# EAGLE design mod.B (EAGLE 7.5.0)
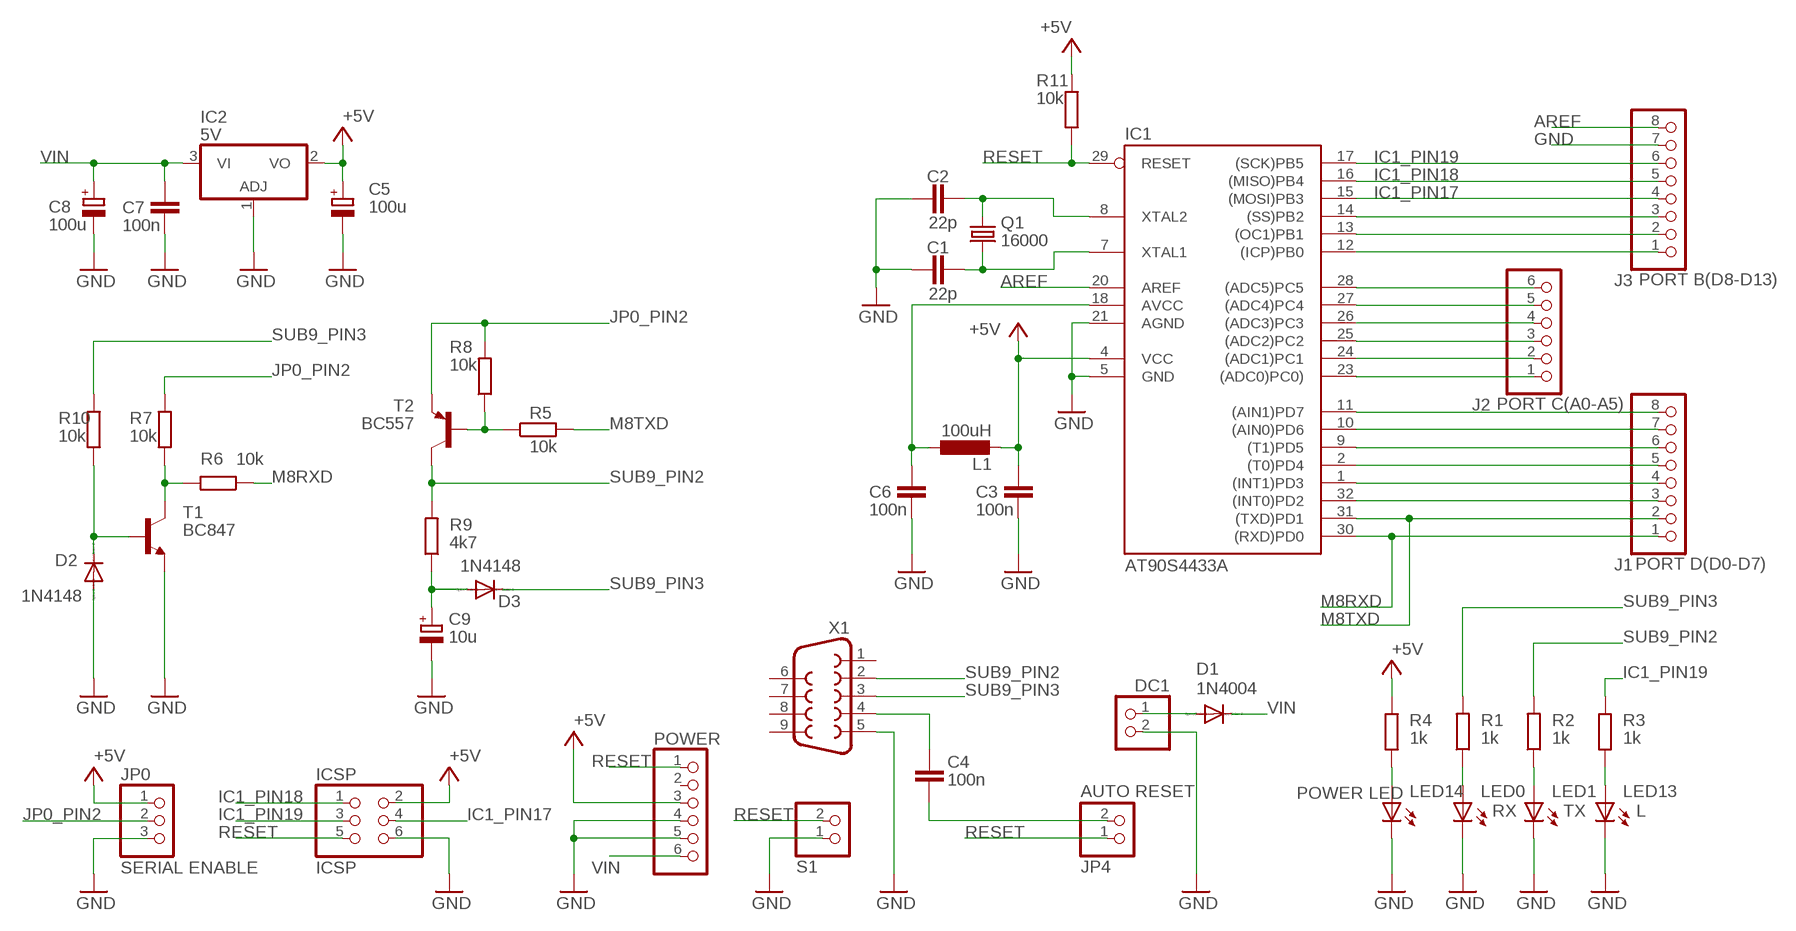
[diagram p0: schematic, sheet 1]

## Parts
C1  22p  C-EUC0805  [C0805]
C2  22p  C-EUC0805  [C0805]
C3  100n  C-EUC0805  [C0805]
C4  100n  C-EUC0805  [C0805]
C5  100u  CPOL-EUD  [PANASONIC_D]
C6  100n  C-EUC0805  [C0805]
C7  100n  C-EUC0805  [C0805]
C8  100u  CPOL-EUD  [PANASONIC_D]
C9  10u  CPOL-EUB  [PANASONIC_B]
D1  1N4004  DIODE-SOD80C  [SOD80C]
D2  1N4148  DIODE-SOD80C  [SOD80C]
D3  1N4148  DIODE-SOD80C  [SOD80C]
DC1  PINHD-1X2  [1X02]
IC1  AT90S4433A  [TQFP32-08]
IC2  5V  AMS1117  [SOT223]
ICSP  ICSP  PINHD-2X3  [2X03]
J1  PORT D(D0-D7)  PINHD-1X8  [1X08]
J2  PORT C(A0-A5)  PINHD-1X6  [1X06]
J3  PORT B(D8-D13)  PINHD-1X8  [1X08]
JP0  SERIAL ENABLE  PINHD-1X3  [1X03]
JP4  AUTO RESET  PINHD-1X2  [1X02]
L1  100uH  L-EUL1812  [L1812]
LED0  RX  LEDCHIP-LED0603  [CHIP-LED0603]
LED1  TX  LEDCHIP-LED0603  [CHIP-LED0603]
LED13  L  LEDCHIP-LED0603  [CHIP-LED0603]
LED14  POWER LED  LEDCHIP-LED0603  [CHIP-LED0603]
POWER  PINHD-1X6  [1X06]
Q1  16000  CRYSTALSM49  [SM49]
R1  1k  R-EU_M0805  [M0805]
R2  1k  R-EU_M0805  [M0805]
R3  1k  R-EU_M0805  [M0805]
R4  1k  R-EU_M0805  [M0805]
R5  10k  R-EU_M0805  [M0805]
R6  10k  R-EU_M0805  [M0805]
R7  10k  R-EU_M0805  [M0805]
R8  10k  R-EU_M0805  [M0805]
R9  4k7  R-EU_R1206  [R1206]
R10  10k  R-EU_M0805  [M0805]
R11  10k  R-EU_M0805  [M0805]
S1  PINHD-1X2  [1X02]
T1  BC847  [SOT23]
T2  BC557  BC857A-PNP-SOT23-BEC  [SOT23-BEC]
X1  F09H  [F09H]

## Nets
+5V [POWER]: C3.1 C5.+ IC1.4(VCC) IC2.2(VO) ICSP.2 JP0.1 L1.2 POWER.3 R4.1 R11.2
AREF [GND]: IC1.20(AREF) J3.8
GND [GND]: C1.1 C2.1 C3.2 C5.- C6.2 C7.2 C8.- C9.- D2.A DC1.2 IC1.5(GND) IC1.21(AGND) IC2.1(ADJ) ICSP.6 J3.7 JP0.3 LED0.C LED1.C LED13.C LED14.C POWER.4 POWER.5 S1.1 T1.2(E) X1.5
IC1_PIN17: IC1.15((MOSI)PB3) ICSP.4 J3.4
IC1_PIN18: IC1.16((MISO)PB4) ICSP.1 J3.5
IC1_PIN19: IC1.17((SCK)PB5) ICSP.3 J3.6 R3.1
JP0_PIN2: JP0.2 R7.2 R8.2 T2.E
M8RXD: IC1.30((RXD)PD0) J1.1 R6.1
M8TXD: IC1.31((TXD)PD1) J1.2 R5.2
N$1: IC1.28((ADC5)PC5) J2.6
N$2: IC1.27((ADC4)PC4) J2.5
N$3: IC1.26((ADC3)PC3) J2.4
N$4: IC1.25((ADC2)PC2) J2.3
N$5: IC1.24((ADC1)PC1) J2.2
N$6: IC1.23((ADC0)PC0)) J2.1
N$7: IC1.11((AIN1)PD7) J1.8
N$8: IC1.10((AIN0)PD6) J1.7
N$9: IC1.9((T1)PD5) J1.6
N$10: IC1.2((T0)PD4) J1.5
N$11: IC1.1((INT1)PD3) J1.4
N$12: IC1.32((INT0)PD2) J1.3
N$13: LED14.A R4.2
N$14: R5.1 R8.1 T2.B
N$15: IC1.12((ICP)PB0) J3.1
N$16: IC1.13((OC1)PB1) J3.2
N$17: IC1.14((SS)PB2) J3.3
N$20: LED13.A R3.2
N$22: C4.1 X1.4
N$23: LED1.A R2.1
N$25: C9.+ D3.A R9.1
N$26: D1.A DC1.1
N$27: C4.2 JP4.2
N$28: D2.C R10.1 T1.1(B)
N$29: R6.2 R7.1 T1.3(C)
N$30: LED0.A R1.1
N$31: C1.2 IC1.7(XTAL1) Q1.1
N$32: C2.2 IC1.8(XTAL2) Q1.2
N$33: C6.1 IC1.18(AVCC) L1.1
RESET: IC1.29(RESET) ICSP.5 JP4.1 POWER.1 R11.1 S1.2
SUB9_PIN2: R2.2 R9.2 T2.C X1.2
SUB9_PIN3: D3.C R1.2 R10.2 X1.3
VIN [POWER]: C7.1 C8.+ D1.C IC2.3(VI) POWER.6
Unconnected: POWER.2 X1.1 X1.6 X1.7 X1.8 X1.9

## Library data of the parts
C1-C4 C6 C7 = resistor:C-EU: CAPACITOR, European symbol
C5 C8 C9 = resistor:CPOL-EU: POLARIZED CAPACITOR, European symbol
D1-D3 = diode:DIODE-: DIODE
DC1 JP4 S1 = pinhead:PINHD-1X2: PIN HEADER
IC1 = atmel:AT90S4433: MICROCONTROLLER 4 Kbytes FLASH 128 bytes SRAM 256 bytes EEPROM UART 6-channel 10 bit ADC; OC_FARNELL: unknown; OC_NEWARK: unknown
IC2 = linear_extended:AMS1117
ICSP = pinhead:PINHD-2X3: PIN HEADER
J1 J3 = pinhead:PINHD-1X8: PIN HEADER
J2 POWER = pinhead:PINHD-1X6: PIN HEADER
JP0 = pinhead:PINHD-1X3: PIN HEADER
L1 = resistor:L-EU: INDUCTOR, European symbol
LED0 LED1 LED13 LED14 = led:LED: LED OSRAM: - CHIPLED LG R971, LG N971, LY N971, LG Q971, LY Q971, LO R971, LY R971 LH N974, LH R974 LS Q976, LO Q976, LY Q976 LO Q996 - Hyper CHIPLED LW Q18S LB Q993, LB Q99A, LB R99A - SideLED LS A670, LO A670, LY A670, LG A670, LP A670 LB A673, LV A673, LT A673, LW A673 LH A674 LY A675 LS A676, LA A676, LO A676, LY A676, LW A676 LS A679, LY A679, LG A679 - Hyper Micro SIDELED® LS Y876, LA Y876, LO Y876, LY Y876 LT Y87S - SmartLED LW L88C, LW L88S LB L89C, LB L89S, LG L890 LS L89K, LO L89K, LY L89K LS L896, LA L896, LO L896, LY L896 - TOPLED LS T670, LO T670, LY T670, LG T670, LP T670 LSG T670, LSP T670, LSY T670, LOP T670, LYG T670 LG T671, LOG T671, LSG T671 LB T673, LV T673, LT T673, LW T673 LH T674 LS T676, LA T676, LO T676, LY T676, LB T676, LH T676, LSB T676, LW T676 LB T67C, LV T67C, LT T67C, LS T67K, LO T67K, LY T67K, LW E67C LS E67B, LA E67B, LO E67B, LY E67B, LB E67C, LV E67C, LT E67C LW T67C LS T679, LY T679, LG T679 LS T770, LO T770, LY T770, LG T770, LP T770 LB T773, LV T773, LT T773, LW T773 LH T774 LS E675, LA E675, LY E675, LS T675 LS T776, LA T776, LO T776, LY T776, LB T776 LHGB T686 LT T68C, LB T68C - Hyper Mini TOPLED® LB M676 - Mini TOPLED Santana® LG M470 LS M47K, LO M47K, LY M47K Source: http://www.osram.convergy.de LUXEON: - LUMILED® LXK2-PW12-R00, LXK2-PW12-S00, LXK2-PW14-U00, LXK2-PW14-V00 LXK2-PM12-R00, LXK2-PM12-S00, LXK2-PM14-U00 LXK2-PE12-Q00, LXK2-PE12-R00, LXK2-PE12-S00, LXK2-PE14-T00, LXK2-PE14-U00 LXK2-PB12-K00, LXK2-PB12-L00, LXK2-PB12-M00, LXK2-PB14-N00, LXK2-PB14-P00, LXK2-PB14-Q00 LXK2-PR12-L00, LXK2-PR12-M00, LXK2-PR14-Q00, LXK2-PR14-R00 LXK2-PD12-Q00, LXK2-PD12-R00, LXK2-PD12-S00 LXK2-PH12-R00, LXK2-PH12-S00 LXK2-PL12-P00, LXK2-PL12-Q00, LXK2-PL12-R00 Source: www.luxeon.com KINGBRIGHT: KA-3528ASYC Source: www.kingbright.com
Q1 = crystal:CRYSTAL: CRYSTAL; OC_FARNELL: unknown; OC_NEWARK: unknown
R1-R11 = resistor:R-EU_: RESISTOR, European symbol
T1 = transistor:BC847: NPN TRANSISTOR
T2 = transistor:*-PNP-: PNP Transistror
X1 = con-subd:F09: SUB-D; OC_FARNELL: unknown; OC_NEWARK: unknown

## Net classes
1 GND: width 0.152 mm
2 POWER: width 0.152 mm

## Board
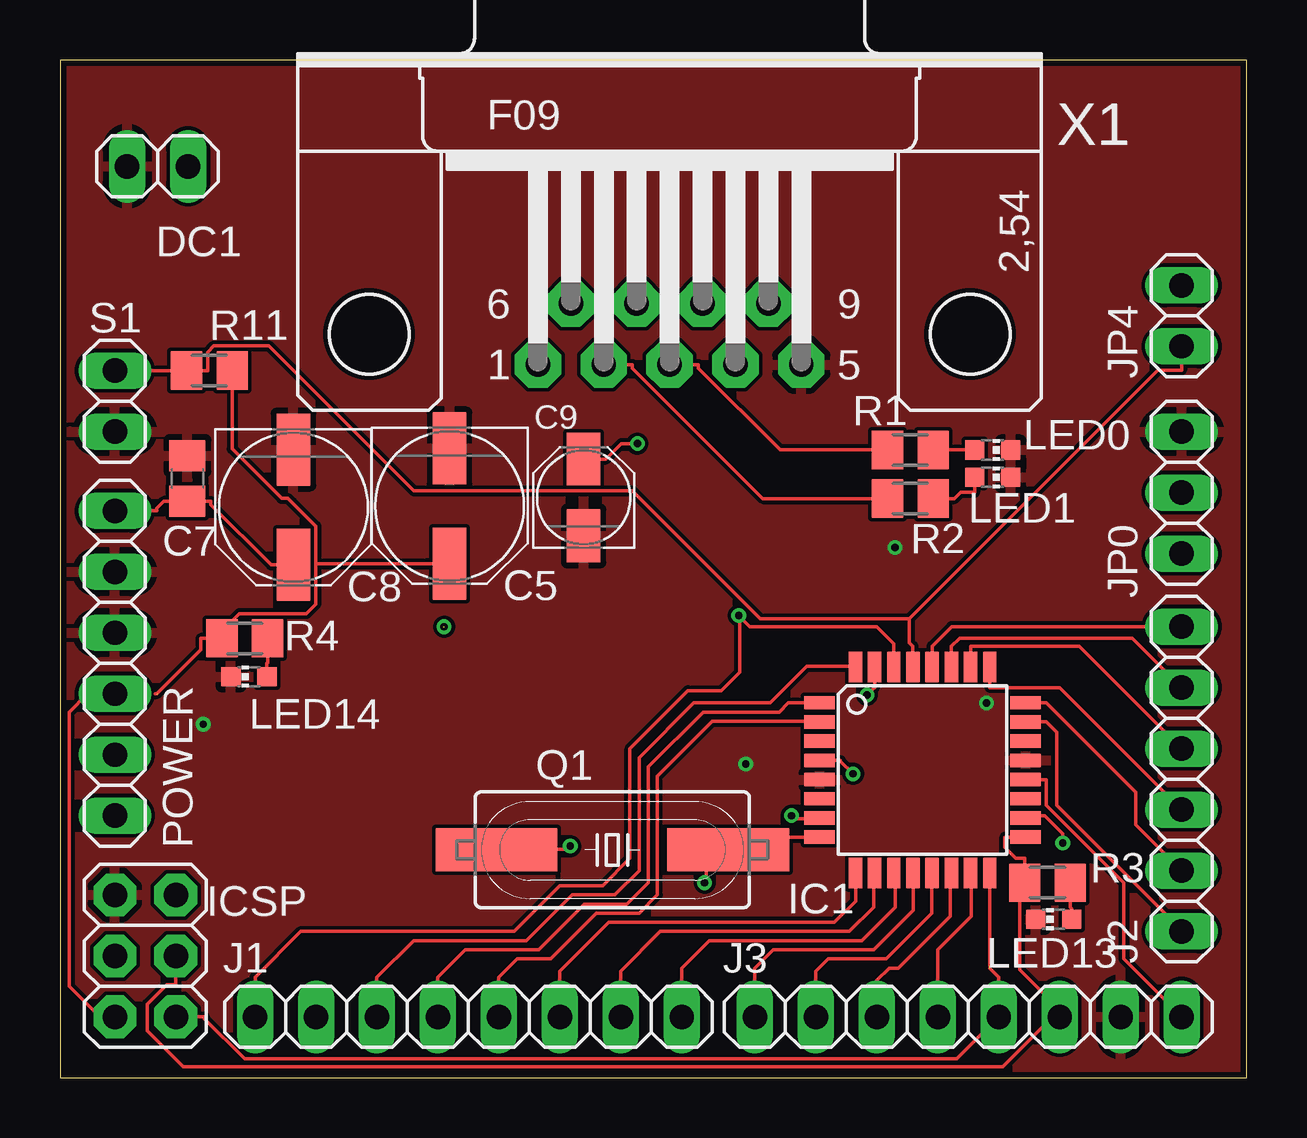
[diagram p1: board, top side]
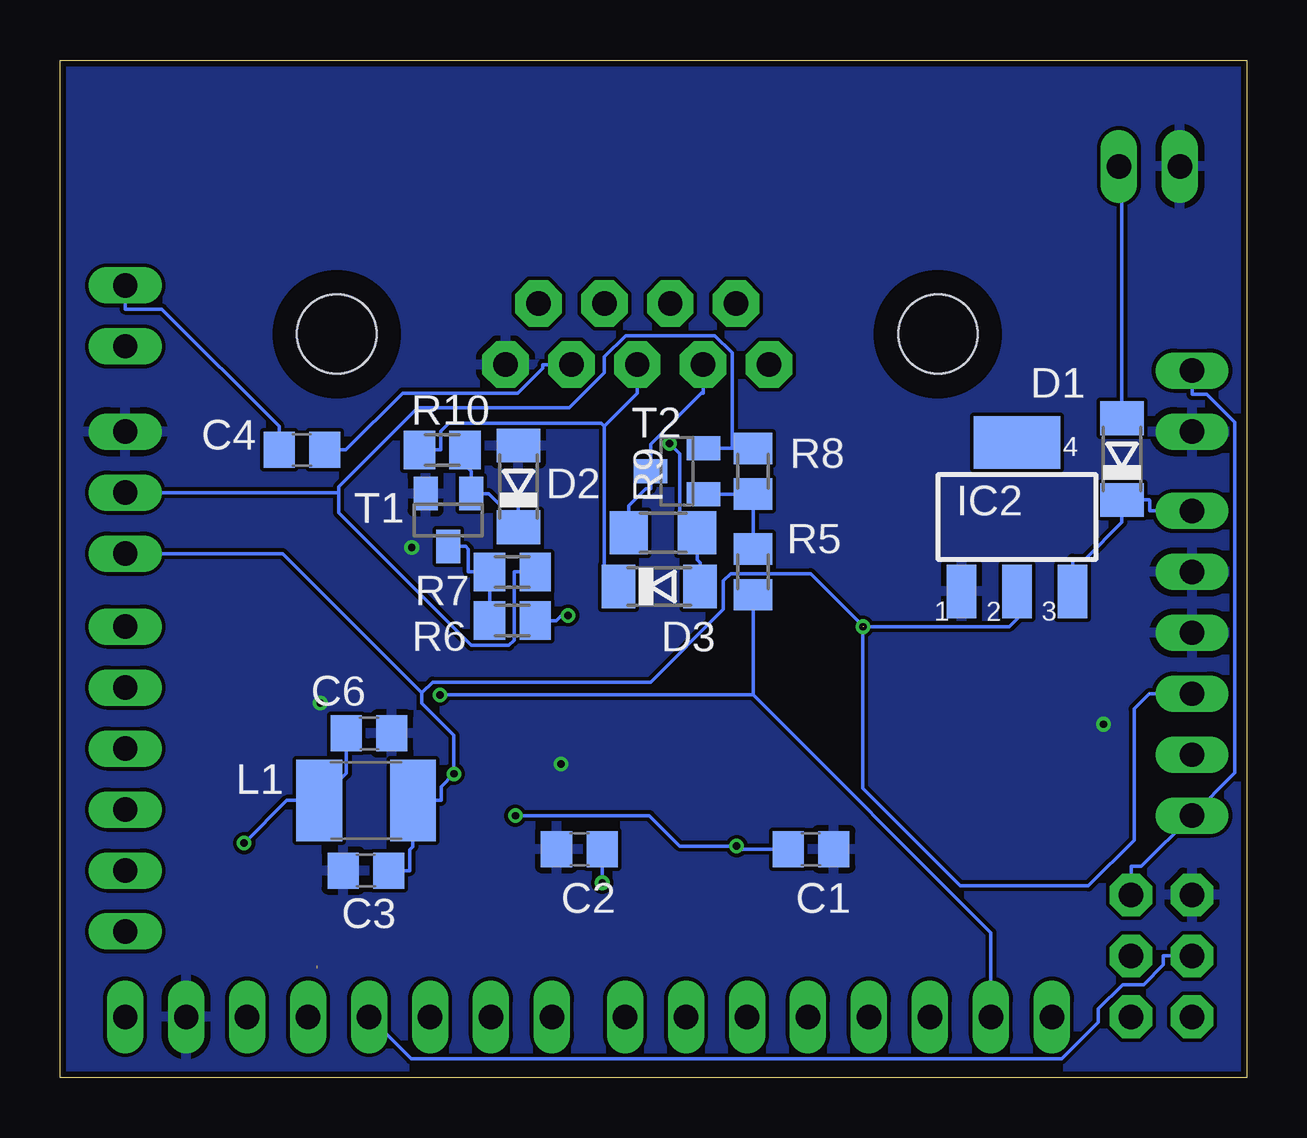
[diagram p2: board, bottom side, seen from below]

Size 49.45 x 42.41 mm. Coordinates in mm from the lower left corner, seen from the top.
Outline: 0,0 49.45,0 49.45,42.41 0,42.41 0,0
Copper layers (1*16): Top 0.035mm / dielectric 1.5mm / Bottom 0.035mm
Design rules "DRU_2layer_no_angle_20140221": minimum track width 6mil, minimum drill 12mil, track to track 6mil, track to pad 6mil, pad to pad 6mil, via to via 6mil, smd to smd 0mil, copper to edge 10mil, drill to drill 10mil, minimum pad ring 10mil, minimum via ring 6mil, stop-mask expansion 2mil, vias tented up to drill 100mil, thermal gap 10mil

### Footprints (pad centres in the part's own frame; a part is rotated, then mirrored left to right if it is on the bottom)
C0805 = smd 1.3 x 1.5: 1 -0.95,0; 2 0.95,0
PANASONIC_D = smd 3 x 1.4: + 2.4,0; - -2.4,0
PANASONIC_B = smd 2.2 x 1.4: + 1.6,0; - -1.6,0
SOD80C = smd 1.4 x 1.8: A 1.7,0; C -1.7,0
1X02 = drill 1.016 long: 1 -1.27,0; 2 1.27,0
TQFP32-08 = smd 1.27 x 0.559: 1 -4.293,2.8; 2 -4.293,2; 3 -4.293,1.2; 4 -4.293,0.4; 5 -4.293,-0.4; 6 -4.293,-1.2; 7 -4.293,-2; 8 -4.293,-2.8; 17 4.293,-2.8; 18 4.293,-2; 19 4.293,-1.2; 20 4.293,-0.4; 21 4.293,0.4; 22 4.293,1.2; 23 4.293,2; 24 4.293,2.8 | smd 0.559 x 1.27: 9 -2.8,-4.293; 10 -2,-4.293; 11 -1.2,-4.293; 12 -0.4,-4.293; 13 0.4,-4.293; 14 1.2,-4.293; 15 2,-4.293; 16 2.8,-4.293; 25 2.8,4.293; 26 2,4.293; 27 1.2,4.293; 28 0.4,4.293; 29 -0.4,4.293; 30 -1.2,4.293; 31 -2,4.293; 32 -2.8,4.293
SOT223 = smd 1.219 x 2.235: 1 -2.311,-3.099; 2 0,-3.099; 3 2.311,-3.099 | smd 3.6 x 2.2: 4 0,3.099
2X03 = drill 1.016 pad 1.778 octagon: 1 -2.54,-1.27; 2 -2.54,1.27; 3 0,-1.27; 4 0,1.27; 5 2.54,-1.27; 6 2.54,1.27
1X08 = drill 1.016 long: 1 -8.89,0; 2 -6.35,0; 3 -3.81,0; 4 -1.27,0; 5 1.27,0; 6 3.81,0; 7 6.35,0; 8 8.89,0
1X06 = drill 1.016 long: 1 -6.35,0; 2 -3.81,0; 3 -1.27,0; 4 1.27,0; 5 3.81,0; 6 6.35,0
1X03 = drill 1.016 long: 1 -2.54,0; 2 0,0; 3 2.54,0
L1812 = smd 1.9 x 3.4: 1 -1.95,0; 2 1.95,0
CHIP-LED0603 = smd 0.8 x 0.8: A 0,-0.75; C 0,0.75
SM49 = smd 5.08 x 1.778: 1 -4.826,0; 2 4.826,0
M0805 = smd 1.3 x 1.6: 1 -0.95,0; 2 0.95,0
R1206 = smd 1.6 x 1.803: 1 -1.422,0; 2 1.422,0
SOT23 = smd 1 x 1.4: 1 -0.95,-1.1; 2 0.95,-1.1; 3 0,1.1
SOT23-BEC = smd 1 x 1.4: B -0.95,-1.1; C 0,1.1; E 0.95,-1.1
F09H = drill 1.016 pad 1.93 octagon: 1 -5.486,-1.27; 2 -2.743,-1.27; 3 0,-1.27; 4 2.743,-1.27; 5 5.486,-1.27; 6 -4.115,1.27; 7 -1.372,1.27; 8 1.372,1.27; 9 4.115,1.27 | hole 3.302: -12.522,0; 12.522,0

### Placement (x,y rotation side)
C1  18.16,9.53 180 bottom
C2  27.81,9.53 0 bottom
C3  36.7,8.64 180 bottom
C4  39.37,26.16 180 bottom
C5  16.23,23.83 270 top
C6  36.58,14.35 0 bottom
C7  5.31,24.97 90 top
C8  9.73,23.77 270 top
C9  21.82,24.18 90 top
D1  5.21,25.78 90 bottom
D2  30.35,24.64 90 bottom
D3  24.49,20.47 0 bottom
DC1  4.06,37.97 180 top
IC1  35.94,12.83 0 top
IC2  9.58,23.37 0 bottom
ICSP  3.56,5.08 90 top
J1  17.02,2.54 0 top
J2  46.74,12.45 90 top
J3  37.85,2.54 0 top
JP0  46.74,24.38 90 top
JP4  46.74,31.75 90 top
L1  36.7,11.56 0 bottom
LED0  38.86,26.16 270 top
LED1  38.86,25.02 270 top
LED13  41.4,6.6 90 top
LED14  7.87,16.71 90 top
POWER  2.29,17.27 90 top
Q1  23.01,9.5 0 top
R1  35.43,26.16 180 top
R2  35.43,24.13 180 top
R3  41.15,8.13 0 top
R4  7.7,18.31 0 top
R5  20.57,21.08 270 bottom
R6  30.61,19.05 180 bottom
R7  30.61,21.08 0 bottom
R8  20.57,25.27 90 bottom
R9  24.33,22.71 180 bottom
R10  33.53,26.16 180 bottom
R11  6.22,29.46 0 top
S1  2.29,28.19 90 top
T1  33.27,23.24 180 bottom
T2  23.75,25.27 90 bottom
X1  25.4,30.99 0 top

### Tracks (layer width: path | path; a pad name or v marks a point on that pad's centre or on a via)
+5V  (via drill 0.3 pad 0.61)  (2 unrouted)
  Top 0.152: 10.66,21.43 10.66,19.73 10.27,19.34 7.47,19.34 6.44,18.31 | R11.2 7.17,26.21 9.23,24.15 9.5,24.15 10.66,22.99 10.66,21.43 | 10.66,21.43 15.3,21.43 C5.+ | 6.44,18.31 5.87,18.31 5.87,17.83 4.04,16 3.96,16 | R4.1 6.44,18.31 | IC1.4 32.51,13.23 32.51,13.2 v33.04,12.66 | ICSP.2 1.65,2.54 0.64,3.56 0.38,3.81 0.38,10.16 0.38,15.24 1.14,16 POWER.3
  Bottom 0.152: 34.38,16.04 33.93,16.49 24.84,16.49 21.82,19.51 21.82,20.7 21.51,21.01 18.18,21.01 16.09,18.92 15.97,18.8 | 34.38,16.04 34.38,15.6 33.04,14.27 v33.04,12.66 33.57,12.13 33.57,11.56 L1.2 34.75,9.63 34.87,9.51 34.87,8.64 C3.1 | 34.38,16.04 40.18,21.84 JP0.1 | IC2.2 9.58,19.13 9.91,18.8 15.97,18.8 | POWER.3 4.06,16 4.7,15.37 4.7,9.91 6.6,8 11.94,8 16,12.06 16,18.76 15.97,18.8
  other vias: 16,18.8
AREF
  Top 0.152: IC1.20 41.1,12.43 41.1,11.35 44.32,8.13 44.32,4.95 J3.8
GND  (via drill 0.3 pad 0.61)
  other vias: 28.57,13.08 38.61,15.62 5.97,14.73 34.8,22.1
  pour Bottom: 0,42.42 49.45,42.42 49.53,0 -0.03,-0.05
  pour Top: 0,42.42 49.45,42.42 49.53,0 -0.03,-0.08
IC1_PIN17
  Top 0.152: J3.4 36.58,5.33 37.97,6.73 37.97,8.5 IC1.15
  Bottom 0.152: ICSP.4 3.48,5.08 3.48,4.71 4.3,3.89 5.18,3.89 6.2,2.87 6.2,2.3 7.72,0.79 34.82,0.79 J3.4
IC1_PIN18  (1 unrouted)
  Top 0.152: ICSP.1 6.02,2.54 6.02,2.46 7.7,0.79 37.36,0.79 J3.5 39.12,4.19 38.73,4.57 | 38.74,4.67 IC1.16
IC1_PIN19
  Top 0.152: IC1.17 39.37,10.03 39.37,9.61 39.82,9.16 40.2,9.16 R3.1 39.99,7.92 39.99,4.5 41.66,2.84 | ICSP.3 4.83,3.89 4.45,3.89 3.63,3.06 3.63,1.97 5.14,0.46 39.28,0.46 41.66,2.84 | 41.66,2.84 J3.6
JP0_PIN2
  Bottom 0.152: R7.2 30.54,21.08 30.54,18.24 30.75,18.02 32.32,18.02 37.84,23.55 37.84,24.38 | 37.84,24.38 37.84,24.62 34.55,27.91 28.23,27.91 26.77,29.38 26.77,30.04 25.89,30.92 22.17,30.92 21.45,30.2 21.45,26.22 | 37.84,24.38 JP0.2 | 21.45,26.22 R8.2 | T2.E 21.45,26.22
M8RXD  (via drill 0.3 pad 0.61)
  Top 0.152: J1.1 8.13,4.19 10.03,6.1 18.92,6.1 20.83,8 22.61,8 23.75,9.14 23.75,13.72 26.16,16.13 27.56,16.13 28.32,16.89 28.32,19.22 v28.28,19.26 28.75,18.8 29.03,18.8 34.04,18.8 34.74,18.09 IC1.30
  Bottom 0.152: R6.1 28.78,19.05 28.57,19.26 v28.28,19.26
M8TXD  (via drill 0.3 pad 0.61)
  Top 0.152: IC1.31 33.94,16.26 33.93,16.26 v33.63,15.95
  Bottom 0.152: 20.57,15.95 10.67,6.05 J1.2 | 20.57,15.95 20.57,19.25 R5.2 | 20.57,15.95 v33.63,15.95
N$1
  Top 0.152: IC1.28 36.34,17.98 37.15,18.8 J2.6
N$2
  Top 0.152: IC1.27 37.14,17.98 37.48,18.32 44.67,18.32 J2.5
N$3
  Top 0.152: IC1.26 37.94,17.98 42.47,17.98 J2.4
N$4
  Top 0.152: IC1.25 38.74,16.26 41.66,16.26 J2.3
N$5
  Top 0.152: IC1.24 41.1,15.63 44.83,11.89 44.83,10.54 J2.2
N$6
  Top 0.152: IC1.23 41.1,14.83 41.53,14.39 41.53,11.35 46.74,6.15 J2.1
N$7
  Top 0.152: 34.9,8.53 IC1.11 34.8,8.48 34.8,7.11 33.4,5.71 27.05,5.71 25.91,4.57 J1.8
N$8
  Top 0.152: J1.7 23.37,4.45 25.02,6.1 32.89,6.1 33.91,7.11 33.91,8.5 IC1.10
N$9
  Top 0.152: J1.6 20.83,4.45 22.86,6.48 32.26,6.48 32.38,6.6 33.15,7.37 IC1.9
N$10
  Top 0.152: J1.5 18.29,4.19 19.05,4.95 20.45,4.95 22.35,6.86 24.13,6.86 24.89,7.62 24.89,12.57 27.18,14.86 31.62,14.86 IC1.2
N$11
  Top 0.152: J1.4 15.75,4.19 16.89,5.33 19.94,5.33 20.07,5.46 21.84,7.24 23.62,7.24 24.51,8.13 24.51,12.95 26.8,15.24 29.97,15.24 30.35,15.62 IC1.1
N$12
  Top 0.152: J1.3 13.21,4.19 14.73,5.71 19.43,5.71 21.34,7.62 23.11,7.62 24.13,8.64 24.13,13.34 26.42,15.62 29.59,15.62 31.11,17.14 33.12,17.14 IC1.32
N$13
  Top 0.152: R4.2 8.65,17.29 8.62,17.26 LED14.A
N$14
  Bottom 0.152: R5.1 R8.1 T2.B
N$15
  Top 0.152: 35.54,8.4 IC1.12 35.56,8.52 35.56,6.99 33.91,5.33 29.72,5.33 28.96,4.57 J3.1
N$16
  Top 0.152: 36.34,8.11 IC1.13 36.32,8.52 36.32,6.86 34.42,4.95 32,4.95 31.88,4.83 31.5,4.45 J3.2
N$17
  Top 0.152: J3.3 34.04,4.06 34.54,4.57 34.92,4.57 37.08,6.73 37.08,8.48 IC1.14
N$20
  Top 0.152: R3.2 42.1,7.1 42.15,7.04 LED13.A
N$22
  Bottom 0.152: C4.1 37.54,26.16 35.18,28.52 30.38,28.52 29.34,29.57 29.34,29.72 X1.4
N$23
  Top 0.152: LED1.A 38.11,24.39 37.52,24.39 37.26,24.13 R2.1
N$25  (via drill 0.3 pad 0.61)
  Top 0.152: C9.+ 22.75,25.78 23.39,26.43 v24.06,26.43
  Bottom 0.152: D3.A 22.79,21.45 22.91,21.58 R9.1 23.64,23.43 23.64,26 v24.06,26.43
N$26
  Bottom 0.152: DC1.1 5.33,38 5.21,37.87 D1.A
N$27
  Bottom 0.152: C4.2 40.32,27.14 45.21,32.03 46.74,32.03 JP4.2
N$28
  Bottom 0.152: D2.C 30.35,23.87 31.12,23.87 31.59,24.34 T1.1 32.32,25.27 32.58,25.52 R10.1
N$29
  Bottom 0.152: T1.3 32.55,22.14 32.44,22.03 32.44,21.08 R7.1 R6.2
N$30
  Top 0.152: R1.1 LED0.A
N$31  (via drill 0.3 pad 0.61)
  Top 0.152: IC1.7 31.62,10.79 30.61,10.79 v30.48,10.92 | v21.26,9.66 21.21,9.66 21.08,9.53 18.21,9.53 Q1.1
  Bottom 0.152: C1.2 21.13,9.53 v21.26,9.66 23.63,9.66 24.89,10.92 v30.48,10.92
N$32  (via drill 0.3 pad 0.61)
  Top 0.152: 31.12,10.03 IC1.8 29.97,10.03 29.44,9.5 Q1.2 27.41,9.5 26.92,9.02 26.92,8.19 v26.86,8.13
  Bottom 0.152: C2.2 v26.86,8.13
N$33  (via drill 0.3 pad 0.61)
  Top 0.152: v41.78,9.78 41.78,10.16 41.02,10.92 40.33,10.92 IC1.18
  Bottom 0.152: C6.1 37.53,12.68 L1.1 40.01,11.56 v41.78,9.78
RESET
  Top 0.152: JP4.1 46.74,29.49 45.74,29.49 35.39,19.13 | 35.39,19.13 35.39,18.14 35.54,17.98 IC1.29 | 35.39,19.13 29.17,19.13 23.85,24.45 14.75,24.45 8.71,30.49 6.41,30.49 6.15,30.23 6.15,29.46 R11.1 S1.2
  Bottom 0.152: ICSP.5 4.83,8.81 4.39,8.81 POWER.1 0.51,12.7 0.51,27.31 1.67,28.47 2.29,28.47 S1.2
SUB9_PIN2
  Top 0.152: X1.2 23.85,29.72 23.85,29.57 29.29,24.13 R2.2
  Bottom 0.152: X1.2 22.66,28.52 22.73,28.52 24.85,26.41 T2.C 24.85,24.54 25.05,24.54 25.75,23.84 R9.2
SUB9_PIN3
  Top 0.152: X1.3 26.59,29.72 26.59,29.57 30,26.16 R1.2
  Bottom 0.152: 26.78,27.14 26.78,21.07 D3.C | 26.78,27.14 25.4,28.52 X1.3 | 26.78,27.14 26.91,27.27 33.26,27.27 33.6,26.93 33.6,26.16 R1.2
VIN
  Top 0.152: POWER.6 4.04,23.62 4.04,23.73 4.33,24.02 C7.1 6.29,24.02 6.29,23.89 8.8,21.37 C8.+
  Bottom 0.152: IC2.3 7.26,21.62 6.74,21.62 5.21,23.15 D1.C 4.08,24.08 4.04,24.04 4.04,23.62 POWER.6